# Altium schematic sheet Disarmer.SchDoc
size A4
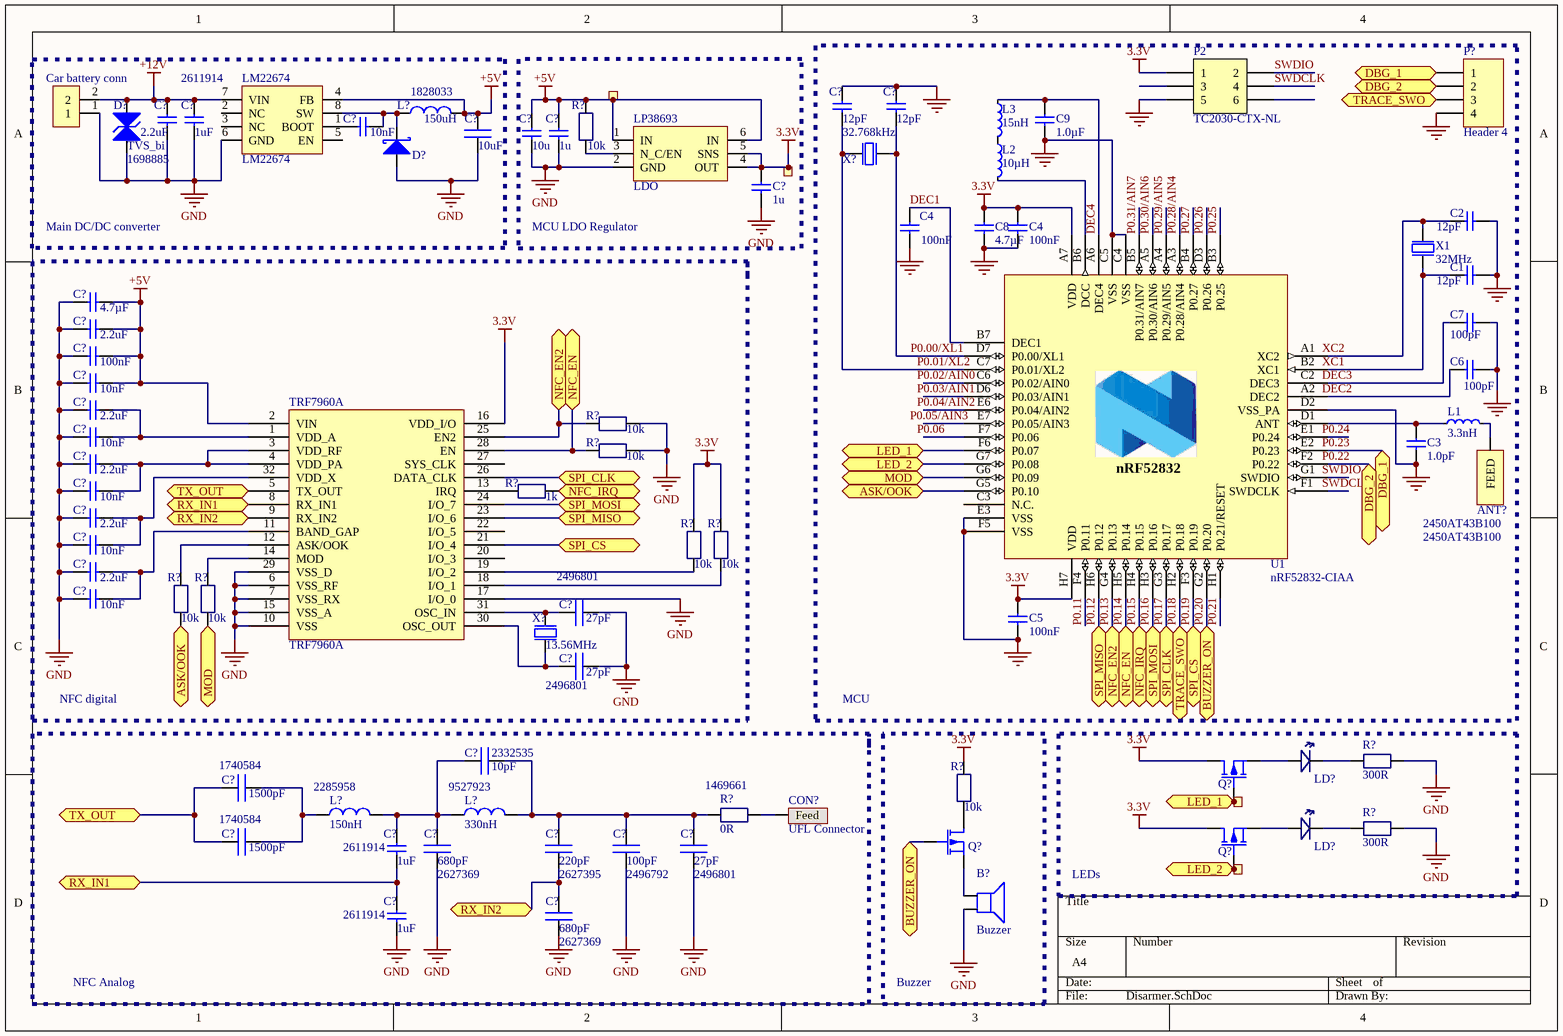
[diagram p0: Disarmer.SchDoc]

## Parts
(Parts that share a designator on the sheet are numbered #1, #2 ... from top to bottom, then left to right.)
?#1  Ø1.0mm,SMD  [TP_SMD_Ř1.0mm]  (value not drawn)  (no BOM)
?#2  Ø1.0mm,SMD  [TP_SMD_Ř1.0mm]  (value not drawn)  (no BOM)
?#3  Ø1.0mm,SMD  [TP_SMD_Ř1.0mm]  (value not drawn)  (no BOM)
?#4  Ø1.0mm,SMD  [TP_SMD_Ř1.0mm]  (value not drawn)  (no BOM)
ANT?  2450AT43B100  [2450AT43B100]
B?  Buzzer  [Buzzer_12mm]
C1  12pF  [CAPC0603X03L]
C2  12pF  [CAPC0603X03L]
C3  1.0pF  [CAPC0603X03L]
C4#1  100nF  [CAPC0603X03L]
C4#2  100nF  [CAPC0603X03L]
C5  100nF  [CAPC0603X03L]
C6  100pF  [CAPC0603X03L]
C7  100pF  [CAPC0603X03L]
C8  4.7µF  [CAPC1608X06L]
C9  1.0µF  [CAPC1005X04L]
C?#1  2.2uF  [CAPC1608X06L]
C?#2  1uF  Supplier Part Number 1: 2611914  [CAPC1608X06L]
C?#3  10u  [CAPC1608X06L]
C?#4  1u  [CAPC1608X06L]
C?#5  10nF  [CAPC0603X03L]
C?#6  12pF  [CAPC0603X03L]
C?#7  12pF  [CAPC0603X03L]
C?#8  10uF  [0805]
C?#9  1u  [CAPC1608X06L]
C?#10  4.7µF  [CAPC1608X06L]
C?#11  2.2uF  [CAPC1608X06L]
C?#12  100nF  [CAPC0603X03L]
C?#13  10nF  [CAPC0603X03L]
C?#14  2.2uF  [CAPC1608X06L]
C?#15  10nF  [CAPC0603X03L]
C?#16  2.2uF  [CAPC1608X06L]
C?#17  10nF  [CAPC0603X03L]
C?#18  2.2uF  [CAPC1608X06L]
C?#19  10nF  [CAPC0603X03L]
C?#20  2.2uF  [CAPC1608X06L]
C?#21  10nF  [CAPC0603X03L]
C?#22  27pF  Supplier Part Number 1: 2496801  [0402]
C?#23  27pF  Supplier Part Number 1: 2496801  [0402]
C?#24  10pF  Supplier Part Number 1: 2332535  [0402]
C?#25  1500pF  Supplier Part Number 1: 1740584  [0402]
C?#26  1uF  Supplier Part Number 1: 2611914  [CAPC1608X06L]
C?#27  1500pF  Supplier Part Number 1: 1740584  [0402]
C?#28  27pF  Supplier Part Number 1: 2496801  [0402]
C?#29  680pF  Supplier Part Number 1: 2627369  [0402]
C?#30  220pF  Supplier Part Number 1: 2627395  [0402]
C?#31  100pF  Supplier Part Number 1: 2496792  [0402]
C?#32  1uF  Supplier Part Number 1: 2611914  [CAPC1608X06L]
C?#33  680pF  Supplier Part Number 1: 2627369  [0402]
Car_battery_conn  (no value)  [ARK_3.5mm]
CON?  UFL Connector  [UFL SMD]
D?#1  TVS_bi  Supplier Part Number 1: 1698885  [DO-214-AB]
D?#2  Shottky  [SOD123F]  (value not drawn)
L1  3.3nH  [INDC0603X03L]
L2  10µH  [INDC1608X06L]
L3  15nH  [INDC1005X04L]
L?#1  150uH  Supplier Part Number 1: 1828033  [8x8]
L?#2  150nH  Supplier Part Number 1: 2285958  [0603]
L?#3  330nH  Supplier Part Number 1: 9527923  [0805]
LD?#1  0603_LED  [LED_0603]  (value not drawn)
LD?#2  0603_LED  [LED_0603]  (value not drawn)
LM22674  LM22674  [HSOP 8-pin]
LP38693  LDO  [WSON-6]
P2  TC2030-CTX-NL  [TC2030-IDC-NLFP]  (no BOM)
P?  Header 4  [HDR1X4]
Q?#1  RZE002P02TLTR-ND  [SOT-416]  (value not drawn)
Q?#2  RZE002P02TLTR-ND  [SOT-416]  (value not drawn)
Q?#3  RZE002P02TLTR-ND  [SOT-416]  (value not drawn)
R?#1  value 10k  [RES_0402]  (hidden comment: RES_0402_1k)
R?#2  value 10k  [RES_0402]  (hidden comment: RES_0402_1k)
R?#3  value 10k  [RES_0402]  (hidden comment: RES_0402_1k)
R?#4  value 1k  [RES_0402]  (hidden comment: RES_0402_1k)
R?#5  value 10k  [RES_0402]  (hidden comment: RES_0402_1k)
R?#6  value 10k  [RES_0402]  (hidden comment: RES_0402_1k)
R?#7  value 10k  [RES_0402]  (hidden comment: RES_0402_1k)
R?#8  value 10k  [RES_0402]  (hidden comment: RES_0402_1k)
R?#9  value 300R  [RES_0402]  (hidden comment: RES_0402_1k)
R?#10  value 10k  [RES_0402]  (hidden comment: RES_0402_1k)
R?#11  value 0R  Supplier Part Number 2: 1469661  [RES_0402]  (hidden comment: RES_0402_1k)
R?#12  value 300R  [RES_0402]  (hidden comment: RES_0402_1k)
TRF7960A  TRF7960A  [RHB32]
U1  nRF52832-CIAA  [BGA50C40P7X8_295X322X50]
X1  32MHz  [BT-XTAL_2016]
X?#1  32.768kHz  [XTAL_2012]
X?#2  13.56MHz  [BT-XTAL_2016]

## Blocks framed on the sheet
Main DC/DC converter: C?#1 C?#2 C?#5 C?#8 Car_battery_conn D?#1 D?#2 L?#1 LM22674
MCU LDO Regulator: ?#1 ?#2 C?#3 C?#4 C?#9 LP38693 R?#1
MCU: ANT? C1-C3 C4#1 C4#2 C5-C9 C?#6 C?#7 L1-L3 P2 P? U1 X1 X?#1
Buzzer: B? Q?#2 R?#10
LEDs: ?#3 ?#4 LD?#1 LD?#2 Q?#1 Q?#3 R?#9 R?#12

## Ports
ASK/OOK, BUZZER_ON, DBG_1, DBG_2, LED_1, LED_2, MOD, NFC_EN, NFC_EN2, NFC_IRQ, RX_IN1, RX_IN2, SPI_CLK, SPI_CS, SPI_MISO, SPI_MOSI, TRACE_SWO, TX_OUT

## Nets
3.3V: ?#2.1 C4#2.1 C5.1 C8.1 C?#9.1 LP38693.4(OUT) LP38693.5(SNS) P2.1 Q?#1.3 Q?#3.3 R?#5.2 R?#6.2 R?#10.1 TRF7960A.16(VDD_I/O) U1.A7(VDD) U1.H7(VDD)
+5V: ?#1.1 C?#3.1 C?#4.1 C?#8.2 C?#10.2 C?#11.1 C?#12.2 C?#13.2 L?#1.2 LM22674.4(FB) LP38693.1(IN) LP38693.6(IN) R?#1.2 TRF7960A.2(VIN)
+12V: C?#1.1 C?#2.1 Car_battery_conn.2 D?#1.2 LM22674.7(VIN)
GND: B?.2 C1.1 C2.1 C3.1 C4#1.2 C4#2.2 C5.2 C6.1 C7.2 C8.2 C9.1 C?#1.2 C?#2.2 C?#3.2 C?#4.2 C?#6.2 C?#7.2 C?#8.1 C?#9.2 C?#10.1 C?#11.2 C?#12.1 C?#13.1 C?#14.2 C?#15.1 C?#16.2 C?#17.1 C?#18.2 C?#19.1 C?#20.2 C?#21.1 C?#22.1 C?#23.1 C?#28.2 C?#29.1 C?#31.1 C?#32.2 C?#33.1 Car_battery_conn.1 CON?.2(GND) D?#1.1 D?#2.1 LM22674.6(GND) LP38693.2(GND) P2.5 P?.4 R?#2.1 R?#3.1 R?#9.1 R?#12.1 TRF7960A.6(VSS_RF) TRF7960A.7(VSS_RX) TRF7960A.10(VSS) TRF7960A.15(VSS_A) TRF7960A.17(I/O_0) TRF7960A.29(VSS_D) U1.C4(VSS) U1.C5(VSS) U1.D2(VSS_PA) U1.E3(VSS) U1.F5(VSS) X1.2(GND) X1.4(GND) X?#2.2(GND) X?#2.4(GND)
ASK/OOK: R?#7.1 U1.G5(P0.10) ; port ASK/OOK
DBG_1: P?.1 U1.E2(P0.23) ; port DBG_1
DBG_2: P?.2 U1.F2(P0.22) ; port DBG_2
DEC1: C4#1.1 U1.B7(DEC1)
DEC4: C9.2 L3.1 U1.A6(DEC4)
LED_1: ?#3.1 Q?#1.1 U1.F6(P0.07) ; port LED_1
LED_2: ?#4.1 Q?#3.1 U1.G7(P0.08) ; port LED_2
MOD: R?#8.1 U1.G6(P0.09) ; port MOD
P0.00/XL1: C?#7.1 U1.D7(P0.00/XL1) X?#1.2(out)
P0.01/XL2: C?#6.1 U1.C7(P0.01/XL2) X?#1.1(inp)
P0.11: U1.F4(P0.11)
P0.12: TRF7960A.23(I/O_6) U1.H6(P0.12) ; port SPI_MISO
P0.13: R?#2.2 TRF7960A.25(EN2) U1.G4(P0.13) ; port NFC_EN2
P0.14: R?#3.2 TRF7960A.28(EN) U1.H5(P0.14) ; port NFC_EN
P0.15: R?#4.2 U1.H4(P0.15) ; port NFC_IRQ
P0.16: TRF7960A.24(I/O_7) U1.H3(P0.16) ; port SPI_MOSI
P0.17: TRF7960A.26(DATA_CLK) U1.G3(P0.17) ; port SPI_CLK
P0.18: P?.3 U1.H2(P0.18) ; port TRACE_SWO
P0.19: TRF7960A.21(I/O_4) U1.F3(P0.19) ; port SPI_CS
P0.20: Q?#2.1 U1.G2(P0.20) ; port BUZZER_ON
P0.21: U1.H1(P0.21/RESET)
P0.25: U1.B3(P0.25)
P0.26: U1.D3(P0.26)
P0.27: U1.B4(P0.27)
P0.28/AIN4: U1.A3(P0.28/AIN4)
P0.29/AIN5: U1.A4(P0.29/AIN5)
P0.30/AIN6: U1.A5(P0.30/AIN6)
P0.31/AIN7: U1.B5(P0.31/AIN7)
RX_IN1: C?#26.2 C?#32.1 TRF7960A.8(RX_IN1) ; port RX_IN1
RX_IN2: C?#30.1 C?#33.2 TRF7960A.9(RX_IN2) ; port RX_IN2
SWDCLK: P2.4
SWDIO: P2.2
TX_OUT: C?#25.1 C?#27.1 TRF7960A.5(TX_OUT) ; port TX_OUT
NetANT?_1: ANT?.1(FEED) L1.2
NetB?_1: B?.1 Q?#2.2
NetC1_2: C1.2 U1.B2(XC1) X1.1(inp)
NetC2_2: C2.2 U1.A1(XC2) X1.3(out)
NetC3_2: C3.2 L1.1 U1.D1(ANT)
NetC6_2: C6.2 U1.A2(DEC2)
NetC7_1: C7.1 U1.C2(DEC3)
NetC?#5_1: C?#5.1 D?#2.2 L?#1.1 LM22674.8(SW)
NetC?#5_2: C?#5.2 LM22674.1(BOOT)
NetC?#14_1: C?#14.1 C?#15.2 TRF7960A.1(VDD_A)
NetC?#16_1: C?#16.1 C?#17.2 TRF7960A.3(VDD_RF) TRF7960A.4(VDD_PA)
NetC?#18_1: C?#18.1 C?#19.2 TRF7960A.32(VDD_X)
NetC?#20_1: C?#20.1 C?#21.2 TRF7960A.11(BAND_GAP)
NetC?#22_2: C?#22.2 TRF7960A.31(OSC_IN) X?#2.3(out)
NetC?#23_2: C?#23.2 TRF7960A.30(OSC_OUT) X?#2.1(inp)
NetC?#24_1: C?#24.1 C?#28.1 C?#30.2 C?#31.2 L?#3.2 R?#11.2
NetC?#24_2: C?#24.2 C?#26.1 C?#29.2 L?#2.2 L?#3.1
NetC?#25_2: C?#25.2 C?#27.2 L?#2.1
NetCON?_1: CON?.1(Feed) R?#11.1
NetL2_1: L2.1 L3.2
NetL2_2: L2.2 U1.B6(DCC)
NetLD?#1_1: LD?#1.1(A) Q?#1.2
NetLD?#1_2: LD?#1.2(K) R?#9.2
NetLD?#2_1: LD?#2.1(A) Q?#3.2
NetLD?#2_2: LD?#2.2(K) R?#12.2
NetLP38693_3: LP38693.3(N_C/EN) R?#1.1
NetQ?#2_3: Q?#2.3 R?#10.2
NetR?#4_1: R?#4.1 TRF7960A.13(IRQ)
NetR?#5_1: R?#5.1 TRF7960A.19(I/O_2)
NetR?#6_1: R?#6.1 TRF7960A.18(I/O_1)
NetR?#7_2: R?#7.2 TRF7960A.12(ASK/OOK)
NetR?#8_2: R?#8.2 TRF7960A.14(MOD)

Not connected (* = marked no-connect by the designer): LM22674 2(NC) 3(NC) 5(EN); P2 3 6; TRF7960A 20(I/O_3) 22(I/O_5) 27(SYS_CLK); U1 C3(N.C.) C6(P0.02/AIN0) D6(P0.03/AIN1) E1(P0.24) E6(P0.04/AIN2) E7(P0.05/AIN3) F1(SWDCLK) F7(P0.06) G1(SWDIO)

## Notes on the sheet
- NFC digital
- NFC Analog
- Labels drawn without touching a wire or pin: DEC2, DEC3, P0.02/AIN0, P0.03/AIN1, P0.04/AIN2, P0.05/AIN3, P0.06, P0.22, P0.23, P0.24, SWDCLK, SWDIO, XC1, XC2
- (in symbol nRF52832-CIAA) nRF52832

## Library data of the parts
?#1-?#4 = TESTPAD: 1.0mm circular SMD testpad; Part Number: TP_SMD_Ø1.0MM; Manufacturer: Nordic Semiconductor; Artikkelnr Noca: N.A.; Manufacturer Part Number: *; Datasheet: *; Footprint: TP_SMD_Ø1.0mm; LatestRevisionDate: 2013-06-11; Pin Count: 1; Publisher: Nordic Semiconductor; Published: 2013-06-11; Value: Ø1.0mm,SMD; Note: *; Supplier: *; Supplier part number: *; 2nd source Supplier: *; 2nd source part number: *
C1 C2 C?#6 C?#7 = C0201-12p: Capacitor, NP0, ±2%; Note: 50V; Artikkelnr Noca: N.A.; Part Number: C0201-12p; Manufacturer: *; Manufacturer Part Number: *; Datasheet: *; LatestRevisionDate: 2014-11-13; Pin Count: 2; Publisher: Nordic Semiconductor; Published: 2014-11-13; Value: 12pF; Supplier: *; Supplier part number: *; 2nd source Supplier: *; 2nd source part number: *; Footprint Doc: 0201; Artikkelnr Simpro: N.A.
C3 = C0201-1.0p: Capacitor, NP0, ±5%; Note: Chip Cap 1%; Artikkelnr Noca: N.A.; Part Number: C0201-1.0p; Manufacturer: *; Manufacturer Part Number: *; Datasheet: *; LatestRevisionDate: 2014-11-13; Pin Count: 2; Publisher: Nordic Semiconductor; Published: 2014-11-13; Value: 1.0pF; Supplier: *; Supplier part number: *; 2nd source Supplier: *; 2nd source part number: *; Footprint Doc: 0201; Artikkelnr Simpro: N.A.
C4#1 C4#2 C5 C?#12 = C0201-100n: Capacitor, X7R, ±10%; Note: 16V; Artikkelnr Noca: N.A.; Part Number: C0201-100n; Manufacturer: *; Manufacturer Part Number: *; Datasheet: *; LatestRevisionDate: 2014-11-13; Pin Count: 2; Publisher: Nordic Semiconductor; Published: 2014-11-13; Value: 100nF; Supplier: *; Supplier part number: *; 2nd source Supplier: *; 2nd source part number: *; Footprint Doc: 0201; Artikkelnr Simpro: N.A.
C6 C7 = C0201-100p: Capacitor, NP0, ±5%; Note: Chip Cap 1%; Artikkelnr Noca: N.A.; Part Number: C0201-100p; Manufacturer: *; Manufacturer Part Number: *; Datasheet: *; LatestRevisionDate: 2014-11-13; Pin Count: 2; Publisher: Nordic Semiconductor; Published: 2014-11-13; Value: 100pF; Supplier: *; Supplier part number: *; 2nd source Supplier: *; 2nd source part number: *; Footprint Doc: 0201; Artikkelnr Simpro: N.A.
C8 C?#10 = C0603-4µ7: Capacitor, X5R, ±10%; Note: 6.3V; Artikkelnr Noca: 20069060; Artikkelnr Simpro: N.A.; Part Number: C0603-4µ7; Manufacturer: *; Manufacturer Part Number: *; Datasheet: *; LatestRevisionDate: 2009-11-23; Pin Count: 2; Publisher: Nordic Semiconductor; Published: 2009-05-08; Value: 4.7µF; Supplier: *; Supplier part number: *; 2nd source Supplier: *; 2nd source part number: *; Footprint Doc: 0603
C9 = C0402-1µ0: Capacitor, X5R, ±5%; Note: 6.3V; Artikkelnr Noca: 20039235; Artikkelnr Simpro: N.A.; Part Number: C0402-1µ0; Manufacturer: *; Manufacturer Part Number: *; Datasheet: *; LatestRevisionDate: 2009-11-23; Pin Count: 2; Publisher: Nordic Semiconductor; Published: 2009-05-08; Value: 1.0µF; Supplier: *; Supplier part number: *; 2nd source Supplier: *; 2nd source part number: *; Footprint Doc: 0402
C?#1-C?#4 C?#9 C?#11 C?#14 C?#16 C?#18 C?#20 C?#26 C?#32 = C0603-4µ7: Capacitor, X5R, ±10%; Value: 4.7µF; Note: 6.3V; Artikkelnr Noca: 20069060; Artikkelnr Simpro: N.A.; Part Number: C0603-4µ7; Manufacturer: *; Manufacturer Part Number: *; Datasheet: *; LatestRevisionDate: 2009-11-23; Pin Count: 2; Publisher: Nordic Semiconductor; Published: 2009-05-08; Supplier: *; Supplier part number: *; 2nd source Supplier: *; 2nd source part number: *; Footprint Doc: 0603
  C?#2 C?#26 C?#32: Supplier 1: Farnell
  C?#3 C?#4 C?#9: Supplier 1: Farnell; Supplier Part Number 1: 1327684
C?#5 C?#13 C?#15 C?#17 C?#19 C?#21 = C0201-100n: Capacitor, X7R, ±10%; Value: 100nF; Note: 16V; Artikkelnr Noca: N.A.; Part Number: C0201-100n; Manufacturer: *; Manufacturer Part Number: *; Datasheet: *; LatestRevisionDate: 2014-11-13; Pin Count: 2; Publisher: Nordic Semiconductor; Published: 2014-11-13; Supplier: *; Supplier part number: *; 2nd source Supplier: *; 2nd source part number: *; Footprint Doc: 0201; Artikkelnr Simpro: N.A.
C?#8 C?#22-C?#25 C?#27-C?#31 C?#33 = Capacitor_MLCC: ?
  C?#22-C?#25 C?#27-C?#31 C?#33: Supplier 1: Farnell
Car_battery_conn = Component_1
D?#1 = TVS_bidirectional: Supplier 1: Farnell
D?#2 = Shottky_diode
L1 = L0201-3n3: High frequency chip inductor ±5%; Artikkelnr Noca: N.A.; Part Number: L0201-3n3; Manufacturer: *; Manufacturer Part Number: *; Datasheet: *; LatestRevisionDate: 2013-04-10; Pin Count: 2; Publisher: Nordic Semiconductor; Published: 2013-04-10; Value: 3.3nH; Note: High frequency chip inductor ±5%; Supplier: *; Supplier part number: *; 2nd source Supplier: *; 2nd source part number: *; Footprint Doc: 0201; Artikkelnr Simpro: N.A.
L2 = L0603-10µ: Chip inductor, IDC,min = 50 mA, ±20%; Manufacturer: Taiyo Yuden; Manufacturer Part Number: LBMF1608T100K; 2nd source part number: 178-6105; Note: LBMF1608T100K 10µH 80mA 0603; Artikkelnr Noca: 33029314; Artikkelnr Simpro: N.A.; Part Number: L0603-10µ; Datasheet: http://www.yuden.co.jp/ut/product/pdf/elb2_e.pdf; LatestRevisionDate: 2012-09-19; Pin Count: 2; Publisher: Nordic Semiconductor; Published: 2010-02-24; Value: 10µH; Supplier: Digi-Key; Supplier part number: 587-1714-1-ND; 2nd source Supplier: Farnell; Footprint Doc: 0603
L3 = L0402-15n: High frequency chip inductor ±10%; Manufacturer: Taiyo Yuden; Manufacturer Part Number: HK100515NJ-T; 2nd source part number: 658-1328; Artikkelnr Noca: 33029323; Artikkelnr Simpro: N.A.; Part Number: L0402-15n; LatestRevisionDate: 2012-09-19; Pin Count: 2; Publisher: Nordic Semiconductor; Published: 2010-07-12; Value: 15nH; Note: High frequency chip inductor ±10%; Supplier: Digi-Key; Datasheet: http://www.yuden.co.jp/productdata/catalog/en/mlci04_e.pdf; Supplier part number: 587-1521-1-ND; 2nd source Supplier: Farnell; Footprint Doc: 0402
L?#1-L?#3 = Inductor: Supplier 1: Farnell
LD?#1 LD?#2 = LED_0603_Blue: Supplier 1: Digi-Key; Supplier 2: TME; Supplier 3: TME; Supplier 4: TME; Supplier 5: TME; Supplier Part Number 1: 160-1647-2-ND; Supplier Part Number 2: LL-S192PBC-B4-1B; Supplier Part Number 3: LL-S194PBC-B4-1B; Supplier Part Number 4: OF-SMD1608B; Supplier Part Number 5: OSB50603C1D
LP38693 = LP38693 WSON Package
P2 = TC2030-CTX-NL: CBL PLUG-OF-NAILS 6-PIN; Manufacturer: Tag-Connect LLC; Artikkelnr Noca: N.A.; Part Number: TC2030-CTX-NL; Manufacturer Part Number: TC2030-CTX-NL; Datasheet: http://www.tag-connect.com/Materials/TC2030-IDC-NL.pdf; LatestRevisionDate: 2013-08-08; Pin Count: 6; Publisher: Nordic Semiconductor; Published: 2013-08-08; Value: TC2030-CTX-NL; Supplier: Tag-Connect; Supplier part number: TC2030-CTX-NL; 2nd source Supplier: *; 2nd source part number: *
P? = Header 4: Header, 4-Pin; LatestRevisionDate: 17-Jul-2002; LatestRevisionNote: Re-released for DXP Platform.; Publisher: Altium Limited
U1 = nRF52832-CIAA: Multi-protocol Bluetooth Low Energy, ANT and 2.4GHz proprietary system-on-chip; Manufacturer: Nordic Semiconductor; Artikkelnr Noca: N.A.; Part Number: nRF52832-CIAA; Manufacturer Part Number: nRF52832-CIAA; Datasheet: *; LatestRevisionDate: 2016-03-11; Pin Count: 54; Publisher: Nordic Semiconductor; Published: 2016-03-11; Value: nRF52832-CIAA; Note: *; Supplier: Nordic Semiconductor; Supplier part number: *; 2nd source Supplier: *; 2nd source part number: *; Footprint Doc: WLCSP_C50; Artikkelnr Simpro: N.A.; Part number IPS: N.A.
X1 X?#2 = XTAL_SMD2016_32MHz_8pF_Epson: XTAL SMD 2016, 32MHz, Cl=8pF, Total Tol: ±40ppm; Manufacturer: Epson Toyocom; Manufacturer Part Number: Q22FA12800025; Note: XTAL SMD 32.000MHz; Artikkelnr Noca: N.A.; Part Number: XTAL_SMD2016_32MHz_8pF_Epson; Datasheet: http://www.epsondevice.com/docs/qd/en/DownloadServlet?id=ID000449; LatestRevisionDate: 2014-11-27; Pin Count: 4; Publisher: Nordic Semiconductor; Published: 2012-03-09; Value: 32MHz; Supplier: Farnell; Supplier part number: 171-2806; 2nd source Supplier: *; 2nd source part number: *; Footprint Doc: XTAL_2016; Artikkelnr Simpro: N.A.
X?#1 = XTAL_SMD2012_32.768kHz_9pF_Seiko: XTAL SMD 2012, 32.768kHz, Cl=9pF, Total Tol: ±50ppm; Manufacturer: Seiko; Manufacturer Part Number: SC20S-9.0PF20PPM; Note: XTAL SMD 32.768kHz, 2012; Artikkelnr Noca: N.A.; Part Number: XTAL_SMD2012_32.768kHz_9pF_Seiko; Datasheet: http://www.sii.co.jp/en/quartz/files/2013/03/file_PRODUCT_MASTER_50811_GRAPHIC03.pdf; LatestRevisionDate: 2015-10-15; Pin Count: 2; Publisher: Nordic Semiconductor; Published: 2015-10-15; Value: 32.768kHz; Supplier: *; Supplier part number: *; 2nd source Supplier: *; 2nd source part number: *; Footprint Doc: XTAL_2012; Artikkelnr Simpro: N.A.
ANT? = 2450AT43B100: Supplier 1: Mouser; Supplier 2: Farnell; Supplier 3: Farnell; Supplier 4: Digi-Key; Supplier 5: Digi-Key; Supplier 6: Digi-Key; Supplier Part Number 1: 609-2450AT43B100E; Supplier Part Number 2: 2148524; Supplier Part Number 3: 2148524RL; Supplier Part Number 4: 712-1010-2-ND; Supplier Part Number 5: 712-1010-1-ND; Supplier Part Number 6: 712-1010-6-ND; Value: 2450AT43B100
CON? = UFL Connector: Supplier 1: Digi-Key; Supplier 2: Digi-Key; Supplier 3: Digi-Key; Supplier 4: Digi-Key; Supplier 5: Digi-Key; Supplier 6: Digi-Key; Supplier 7: Farnell; Supplier 8: Farnell; Supplier Part Number 1: H9161DKR-ND; Supplier Part Number 2: H11891CT-ND; Supplier Part Number 3: H11891DKR-ND; Supplier Part Number 4: H9161CT-ND; Supplier Part Number 5: H9161TR-ND; Supplier Part Number 6: H11891TR-ND; Supplier Part Number 7: 1688077; Supplier Part Number 8: 1688077RL
Q?#1-Q?#3 = RZE002P02TLTR-ND: Supplier 1: Digi-Key; Supplier 2: Digi-Key; Supplier 3: Digi-Key; Supplier Part Number 1: RZE002P02TLTR-ND; Supplier Part Number 2: RZE002P02TLCT-ND; Supplier Part Number 3: RZE002P02TLDKR-ND; Value: RZE002P02TL
R?#1-R?#12 = RES_0402_1k: Supplier 2: Farnell
  R?#1-R?#10 R?#12: Supplier 1: Digi-Key; Supplier 3: Mouser; Supplier Part Number 1: 311-1.0KJRTR-ND; Supplier Part Number 2: 1358043; Supplier Part Number 3: 603-RC0402FR-071KL
  R?#11: Supplier 1: Mouser; Supplier Part Number 1: 603-RC0402FR-071KL